# Altium schematic sheet SAMV71_Xplained_Ultra_Target_MCU.SchDoc: Target MCU
size A3; Organization: ATMEL Norway; Address1: Vestre Rosten 79; Address2: N-7075 TILLER; Address3: NORWAY; DocumentNumber: A09-2407; Revision: 2; SheetNumber: 5; SheetTotal: 13; PageSetup: Record=PageOptions|CenterHorizontal=True|CenterVertical=True|PrintScale=1.01|XCorrection=1.00|YCorrection=1.00|PrintKind=1|BorderSize=5000000|LeftOffset=0|BottomOffset=0|Orientation=2|PaperLength=1000|PaperWidth=1000|Scale=100|PaperSource=7|PrintQuality=-4|MediaType=1|DitherType=10|PaperKind=A3 (297 x 420 mm)|PrintScaleMode=1
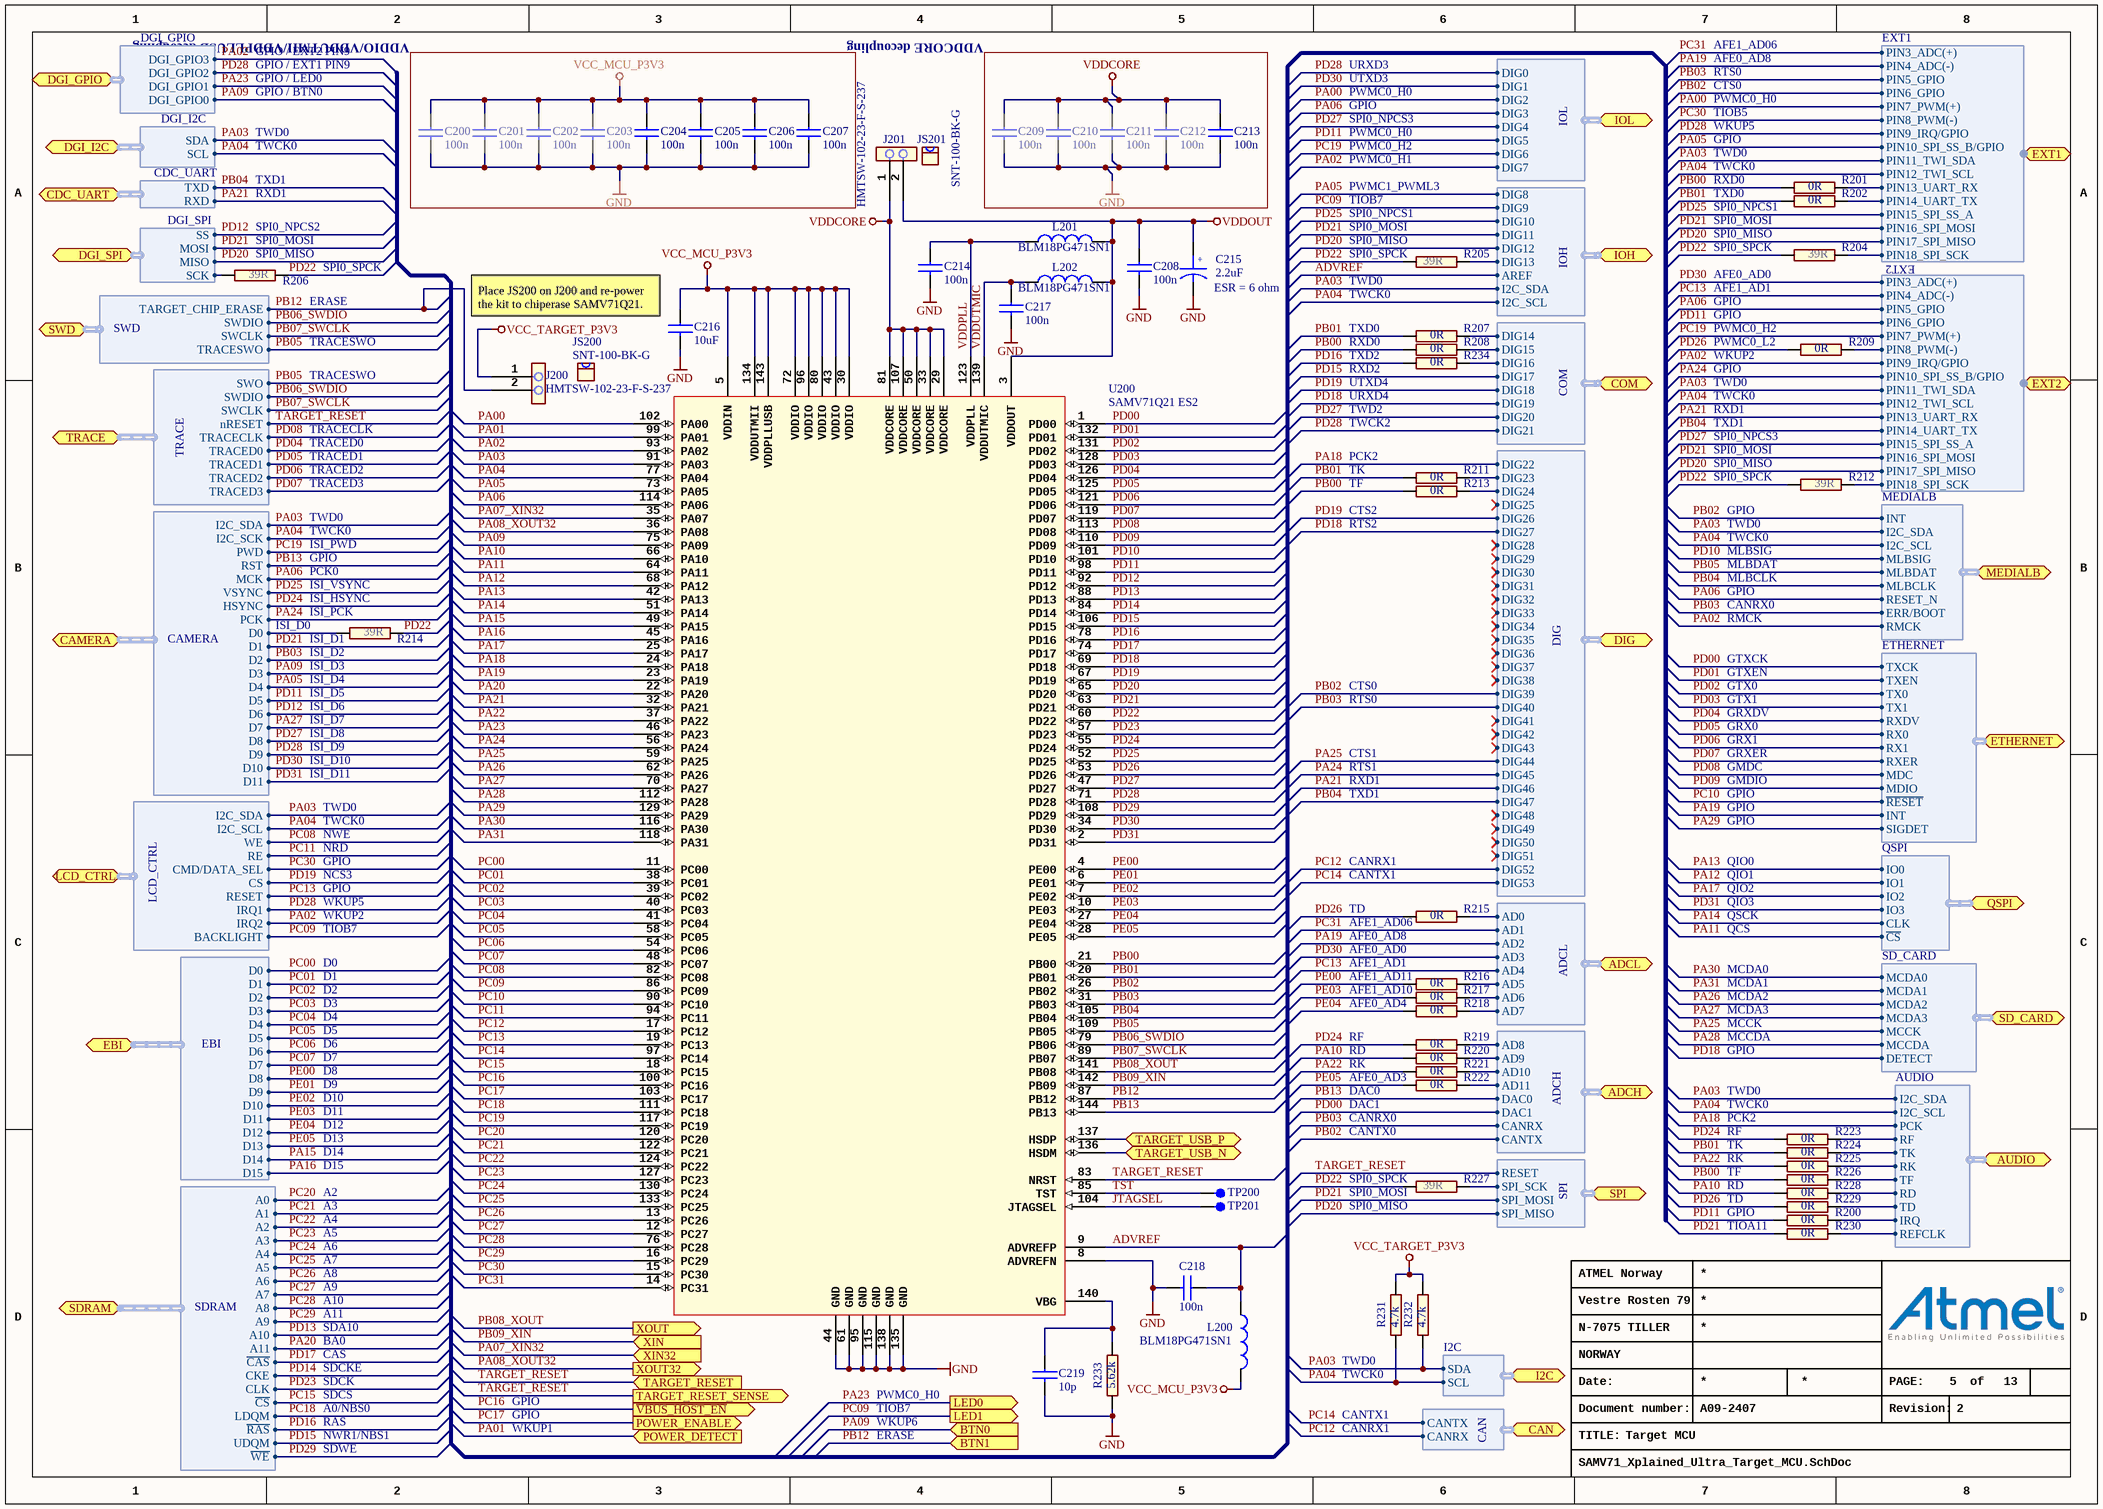
[diagram p0: SAMV71_Xplained_Ultra_Target_MCU.SchDoc]

## Parts
C200  value 100n  [AP1-00001]  (hidden comment: CAP-NONPOL)
C201  value 100n  [AP1-00001]  (hidden comment: CAP-NONPOL)
C202  value 100n  [AP1-00001]  (hidden comment: CAP-NONPOL)
C203  value 100n  [AP1-00001]  (hidden comment: CAP-NONPOL)
C204  value 100n  [AP1-00001]  (hidden comment: CAP-NONPOL)
C205  value 100n  [AP1-00001]  (hidden comment: CAP-NONPOL)
C206  value 100n  [AP1-00001]  (hidden comment: CAP-NONPOL)
C207  value 100n  [AP1-00001]  (hidden comment: CAP-NONPOL)
C208  value 100n  [AP1-00001]  (hidden comment: CAP-NONPOL)
C209  value 100n  [AP1-00001]  (hidden comment: CAP-NONPOL)
C210  value 100n  [AP1-00001]  (hidden comment: CAP-NONPOL)
C211  value 100n  [AP1-00001]  (hidden comment: CAP-NONPOL)
C212  value 100n  [AP1-00001]  (hidden comment: CAP-NONPOL)
C213  value 100n  [AP1-00001]  (hidden comment: CAP-NONPOL)
C214  value 100n  [AP1-00001]  (hidden comment: CAP-NONPOL)
C215  ESR = 6 ohm  value 2.2uF  [AP1-00036]
C216  value 10uF  [AP1-00041]  (hidden comment: CAP-NONPOL)
C217  value 100n  [AP1-00001]  (hidden comment: CAP-NONPOL)
C218  value 100n  [AP1-00001]  (hidden comment: CAP-NONPOL)
C219  10p  [AP1-00053]
J200  value HMTSW-102-23-F-S-237  [AP8-00733]  (hidden comment: HEADER 1x2)
J201  value HMTSW-102-23-F-S-237  [AP8-00733]  (hidden comment: HEADER 1x2)
JS200  value SNT-100-BK-G  [AP8-00525]
JS201  value SNT-100-BK-G  [AP8-00525]
L200  value BLM18PG471SN1  [AP3-00005]  (hidden comment: INDUCTOR)
L201  value BLM18PG471SN1  [AP3-00005]  (hidden comment: INDUCTOR)
L202  value BLM18PG471SN1  [AP3-00005]  (hidden comment: INDUCTOR)
R200  value 0R  [AP2-00000]  (hidden comment: R2)
R201  value 0R  [AP2-00000]  (hidden comment: R2)
R202  value 0R  [AP2-00000]  (hidden comment: R2)
R204  value 39R  [AP2-00000]  (hidden comment: R2)
R205  value 39R  [AP2-00000]  (hidden comment: R2)
R206  value 39R  [AP2-00000]  (hidden comment: R2)
R207  value 0R  [AP2-00000]  (hidden comment: R2)
R208  value 0R  [AP2-00000]  (hidden comment: R2)
R209  value 0R  [AP2-00000]  (hidden comment: R2)
R211  value 0R  [AP2-00000]  (hidden comment: R2)
R212  value 39R  [AP2-00000]  (hidden comment: R2)
R213  value 0R  [AP2-00000]  (hidden comment: R2)
R214  value 39R  [AP2-00000]  (hidden comment: R2)
R215  value 0R  [AP2-00000]  (hidden comment: R2)
R216  value 0R  [AP2-00000]  (hidden comment: R2)
R217  value 0R  [AP2-00000]  (hidden comment: R2)
R218  value 0R  [AP2-00000]  (hidden comment: R2)
R219  value 0R  [AP2-00000]  (hidden comment: R2)
R220  value 0R  [AP2-00000]  (hidden comment: R2)
R221  value 0R  [AP2-00000]  (hidden comment: R2)
R222  value 0R  [AP2-00000]  (hidden comment: R2)
R223  value 0R  [AP2-00000]  (hidden comment: R2)
R224  value 0R  [AP2-00000]  (hidden comment: R2)
R225  value 0R  [AP2-00000]  (hidden comment: R2)
R226  value 0R  [AP2-00000]  (hidden comment: R2)
R227  value 39R  [AP2-00000]  (hidden comment: R2)
R228  value 0R  [AP2-00000]  (hidden comment: R2)
R229  value 0R  [AP2-00000]  (hidden comment: R2)
R230  value 0R  [AP2-00000]  (hidden comment: R2)
R231  value 4.7k  [AP2-00000]  (hidden comment: R2)
R232  value 4.7k  [AP2-00000]  (hidden comment: R2)
R233  value 5.62k  [AP2-00000]  (hidden comment: R2)
R234  value 0R  [AP2-00000]  (hidden comment: R2)
TP200  TESTPOINT  [AP8-00010]  (value not drawn)  (no BOM)
TP201  TESTPOINT  [AP8-00010]  (value not drawn)  (no BOM)
U200  value SAMV71Q21 ES2  [AP6-00118]

## Blocks framed on the sheet
VDDIO/VDDUTMII/VDDPLLUSB decoupling: C200-C207
VDDCORE decoupling: C209-C213

## Ports
ADCH (harness ADCH), ADCL (harness ADCL), AUDIO (harness AUDIO), BTN0 (in), BTN1 (in), CAMERA (harness CAMERA), CAN (harness CAN), CDC_UART (harness CDC_UART), COM (harness COM), DGI_GPIO (harness DGI_GPIO), DGI_I2C (harness DGI_I2C), DGI_SPI (harness DGI_SPI), DIG (harness DIG), EBI (harness EBI), ETHERNET (harness ETHERNET), EXT1 (harness EXT1), EXT2 (harness EXT2), I2C (harness I2C), IOH (harness IOH), IOL (harness IOL), LCD_CTRL (harness LCD_CTRL), LED0 (out), LED1 (out), MEDIALB (harness MEDIALB), POWER_DETECT (in), POWER_ENABLE (out), QSPI (harness QSPI), SD_CARD (harness SD_CARD), SDRAM (harness SDRAM), SPI (harness SPI), SWD (harness SWD), TARGET_RESET (in), TARGET_RESET_SENSE (out), TARGET_USB_N (bidir), TARGET_USB_P (bidir), TRACE (harness TRACE), XIN32 (in), XIN (in), XOUT32 (out), XOUT (out), ~{VBUS_HOST_EN} (out)

## Harnesses
SWD: SWCLK, SWDIO, TARGET_CHIP_ERASE, TRACESWO
DGI_GPIO: DGI_GPIO0, DGI_GPIO1, DGI_GPIO2, DGI_GPIO3
DGI_SPI: MISO, MOSI, SCK, SS
DGI_I2C: SCL, SDA
CDC_UART: RXD, TXD
EXT1: PIN10_SPI_SS_B/GPIO, PIN11_TWI_SDA, PIN12_TWI_SCL, PIN13_UART_RX, PIN14_UART_TX, PIN15_SPI_SS_A, PIN16_SPI_MOSI, PIN17_SPI_MISO, PIN18_SPI_SCK, PIN3_ADC(+), PIN4_ADC(-), PIN5_GPIO, PIN6_GPIO, PIN7_PWM(+), PIN8_PWM(-), PIN9_IRQ/GPIO
EXT2: PIN10_SPI_SS_B/GPIO, PIN11_TWI_SDA, PIN12_TWI_SCL, PIN13_UART_RX, PIN14_UART_TX, PIN15_SPI_SS_A, PIN16_SPI_MOSI, PIN17_SPI_MISO, PIN18_SPI_SCK, PIN3_ADC(+), PIN4_ADC(-), PIN5_GPIO, PIN6_GPIO, PIN7_PWM(+), PIN8_PWM(-), PIN9_IRQ/GPIO
EBI: D0, D1, D2, D3, D4, D5, D6, D7, D8, D9, D10, D11, D12, D13, D14, D15
CAMERA: MCK, VSYNC, HSYNC, PCK, D0, D1, D2, D3, D4, D5, D6, D7, D8, D9, D10, D11, I2C_SCK, I2C_SDA, RST, PWD
ETHERNET: TX0, TX1, TXEN, TXCK, RX0, RX1, MDC, MDIO, RXER, RXDV, INT, ~{RESET}, SIGDET
QSPI: CLK, IO3, IO2, IO0, IO1, ~{CS}
SDRAM: ~{CAS}, ~{RAS}, ~{CS}, CLK, CKE, ~{WE}, LDQM, UDQM, A0, A1, A2, A3, A4, A5, A6, A7, A8, A9, A10, A11
SD_CARD: MCCDA, MCCK, MCDA3, MCDA2, MCDA1, MCDA0, DETECT
AUDIO: I2C_SDA, I2C_SCL, PCK, TK, RK, TF, RD, TD, IRQ, REFCLK, RF
ADCL: AD0, AD1, AD2, AD3, AD4, AD5, AD6, AD7
ADCH: AD8, AD9, AD10, AD11, DAC0, DAC1, CANRX, CANTX
DIG: DIG22, DIG23, DIG24, DIG25, DIG26, DIG27, DIG28, DIG29, DIG30, DIG31, DIG32, DIG33, DIG34, DIG35, DIG36, DIG37, DIG38, DIG39, DIG40, DIG41, DIG42, DIG43, DIG44, DIG45, DIG46, DIG47, DIG48, DIG49, DIG50, DIG51, DIG52, DIG53
CAN: CANTX, CANRX
I2C: SDA, SCL
LCD_CTRL: CMD/DATA_SEL, CS, WE, RE, I2C_SDA, I2C_SCL, IRQ1, IRQ2, BACKLIGHT, RESET
SPI: SPI_MISO, SPI_MOSI, SPI_SCK, RESET
TRACE: SWDIO, SWCLK, TRACECLK, TRACED0, TRACED1, TRACED2, TRACED3, nRESET, SWO
MEDIALB: MLBSIG, MLBDAT, MLBCLK, I2C_SDA, I2C_SCL, INT, ERR/BOOT, RESET_N, RMCK
COM: DIG14, DIG15, DIG16, DIG17, DIG18, DIG19, DIG20, DIG21
IOH: DIG8, DIG9, DIG10, DIG11, DIG12, DIG13, AREF, I2C_SCL, I2C_SDA
IOL: DIG0, DIG1, DIG2, DIG3, DIG4, DIG5, DIG6, DIG7

## Nets
GND: C200.2 C201.2 C202.2 C203.2 C204.2 C205.2 C206.2 C207.2 C208.2 C209.2 C210.2 C211.2 C212.2 C213.2 C214.2 C215.2 C216.2 C217.2 C218.2 C219.2 R233.1 U200.8(ADVREFN) U200.44(GND) U200.61(GND) U200.95(GND) U200.115(GND) U200.135(GND) U200.138(GND)
VCC_MCU_P3V3: C200.1 C201.1 C202.1 C203.1 C204.1 C205.1 C206.1 C207.1 C216.1 L200.1 U200.5(VDDIN) U200.30(VDDIO) U200.43(VDDIO) U200.72(VDDIO) U200.80(VDDIO) U200.96(VDDIO) U200.134(VDDUTMII) U200.143(VDDPLLUSB)
VCC_TARGET_P3V3: J200.1 R231.1 R232.1
VDDCORE: C209.1 C210.1 C211.1 C212.1 C213.1 J201.1 U200.29(VDDCORE) U200.33(VDDCORE) U200.50(VDDCORE) U200.81(VDDCORE) U200.107(VDDCORE)
VDDOUT: C208.1 C215.1 J201.2 L201.1 L202.1 U200.3(VDDOUT)
ADVREF: C218.1 L200.2 U200.9(ADVREFP) ; port IOH.AREF
JTAGSEL: TP201.1 U200.104(JTAGSEL)
PA00: U200.102(PA00) ; port EXT1.PIN7_PWM(+), port IOL.DIG2
PA01: U200.99(PA01) ; port POWER_DETECT
PA02: U200.93(PA02) ; port DGI_GPIO.DGI_GPIO3, port EXT2.PIN9_IRQ/GPIO, port LCD_CTRL.IRQ2, port MEDIALB.RMCK, port IOL.DIG7
PA03: R232.2 U200.91(PA03) ; port DGI_I2C.SDA, port EXT1.PIN11_TWI_SDA, port EXT2.PIN11_TWI_SDA, port CAMERA.I2C_SDA, port AUDIO.I2C_SDA, port I2C.SDA, port LCD_CTRL.I2C_SDA, port MEDIALB.I2C_SDA, port IOH.I2C_SDA
PA04: R231.2 U200.77(PA04) ; port DGI_I2C.SCL, port EXT1.PIN12_TWI_SCL, port EXT2.PIN12_TWI_SCL, port CAMERA.I2C_SCK, port AUDIO.I2C_SCL, port I2C.SCL, port LCD_CTRL.I2C_SCL, port MEDIALB.I2C_SCL, port IOH.I2C_SCL
PA05: U200.73(PA05) ; port EXT1.PIN10_SPI_SS_B/GPIO, port CAMERA.D4, port IOH.DIG8
PA06: U200.114(PA06) ; port EXT2.PIN5_GPIO, port CAMERA.MCK, port MEDIALB.RESET_N, port IOL.DIG3
PA07_XIN32: U200.35(PA07) ; port XIN32
PA08_XOUT32: U200.36(PA08) ; port XOUT32
PA09: U200.75(PA09) ; port BTN0, port DGI_GPIO.DGI_GPIO0, port CAMERA.D3
PA10: R220.1 R228.1 U200.66(PA10)
PA11: U200.64(PA11) ; port QSPI.~{CS}
PA12: U200.68(PA12) ; port QSPI.IO1
PA13: U200.42(PA13) ; port QSPI.IO0
PA14: U200.51(PA14) ; port QSPI.CLK
PA15: U200.49(PA15) ; port EBI.D14
PA16: U200.45(PA16) ; port EBI.D15
PA17: U200.25(PA17) ; port QSPI.IO2
PA18: U200.24(PA18) ; port AUDIO.PCK, port DIG.DIG22
PA19: U200.23(PA19) ; port EXT1.PIN4_ADC(-), port ETHERNET.INT, port ADCL.AD2
PA20: U200.22(PA20) ; port SDRAM.A11
PA21: U200.32(PA21) ; port CDC_UART.RXD, port EXT2.PIN13_UART_RX, port DIG.DIG46
PA22: R221.1 R225.1 U200.37(PA22)
PA23: U200.46(PA23) ; port LED0, port DGI_GPIO.DGI_GPIO1
PA24: U200.56(PA24) ; port EXT2.PIN10_SPI_SS_B/GPIO, port CAMERA.PCK, port DIG.DIG45
PA25: U200.59(PA25) ; port SD_CARD.MCCK, port DIG.DIG44
PA26: U200.62(PA26) ; port SD_CARD.MCDA2
PA27: U200.70(PA27) ; port CAMERA.D7, port SD_CARD.MCDA3
PA28: U200.112(PA28) ; port SD_CARD.MCCDA
PA29: U200.129(PA29) ; port ETHERNET.SIGDET
PA30: U200.116(PA30) ; port SD_CARD.MCDA0
PA31: U200.118(PA31) ; port SD_CARD.MCDA1
PB00: R201.1 R208.1 R213.1 R226.1 U200.21(PB00)
PB01: R202.1 R207.1 R211.1 R224.1 U200.20(PB01)
PB02: U200.26(PB02) ; port EXT1.PIN6_GPIO, port ADCH.CANTX, port DIG.DIG39, port MEDIALB.INT
PB03: U200.31(PB03) ; port EXT1.PIN5_GPIO, port CAMERA.D2, port ADCH.CANRX, port DIG.DIG40, port MEDIALB.ERR/BOOT
PB04: U200.105(PB04) ; port CDC_UART.TXD, port EXT2.PIN14_UART_TX, port DIG.DIG47, port MEDIALB.MLBCLK
PB05: U200.109(PB05) ; port SWD.TRACESWO, port TRACE.SWO, port MEDIALB.MLBDAT
PB06_SWDIO: U200.79(PB06) ; port SWD.SWDIO, port TRACE.SWDIO
PB07_SWCLK: U200.89(PB07) ; port SWD.SWCLK, port TRACE.SWCLK
PB08_XOUT: U200.141(PB08) ; port XOUT
PB09_XIN: U200.142(PB09) ; port XIN
PB12: J200.2 U200.87(PB12) ; port BTN1, port SWD.TARGET_CHIP_ERASE
PB13: U200.144(PB13) ; port CAMERA.RST, port ADCH.DAC0
PC00: U200.11(PC00) ; port EBI.D0
PC01: U200.38(PC01) ; port EBI.D1
PC02: U200.39(PC02) ; port EBI.D2
PC03: U200.40(PC03) ; port EBI.D3
PC04: U200.41(PC04) ; port EBI.D4
PC05: U200.58(PC05) ; port EBI.D5
PC06: U200.54(PC06) ; port EBI.D6
PC07: U200.48(PC07) ; port EBI.D7
PC08: U200.82(PC08) ; port LCD_CTRL.WE
PC09: U200.86(PC09) ; port LED1, port LCD_CTRL.BACKLIGHT, port IOH.DIG9
PC10: U200.90(PC10) ; port ETHERNET.~{RESET}
PC11: U200.94(PC11) ; port LCD_CTRL.RE
PC12: U200.17(PC12) ; port DIG.DIG52, port CAN.CANRX
PC13: U200.19(PC13) ; port EXT2.PIN4_ADC(-), port ADCL.AD4, port LCD_CTRL.RESET
PC14: U200.97(PC14) ; port DIG.DIG53, port CAN.CANTX
PC15: U200.18(PC15) ; port SDRAM.~{CS}
PC16: U200.100(PC16) ; port ~{VBUS_HOST_EN}
PC17: U200.103(PC17) ; port POWER_ENABLE
PC18: U200.111(PC18) ; port SDRAM.LDQM
PC19: U200.117(PC19) ; port EXT2.PIN7_PWM(+), port CAMERA.PWD, port IOL.DIG6
PC20: U200.120(PC20) ; port SDRAM.A0
PC21: U200.122(PC21) ; port SDRAM.A1
PC22: U200.124(PC22) ; port SDRAM.A2
PC23: U200.127(PC23) ; port SDRAM.A3
PC24: U200.130(PC24) ; port SDRAM.A4
PC25: U200.133(PC25) ; port SDRAM.A5
PC26: U200.13(PC26) ; port SDRAM.A6
PC27: U200.12(PC27) ; port SDRAM.A7
PC28: U200.76(PC28) ; port SDRAM.A8
PC29: U200.16(PC29) ; port SDRAM.A9
PC30: U200.15(PC30) ; port EXT1.PIN8_PWM(-), port LCD_CTRL.CMD/DATA_SEL
PC31: U200.14(PC31) ; port EXT1.PIN3_ADC(+), port ADCL.AD1
PD00: U200.1(PD00) ; port ETHERNET.TXCK, port ADCH.DAC1
PD01: U200.132(PD01) ; port ETHERNET.TXEN
PD02: U200.131(PD02) ; port ETHERNET.TX0
PD03: U200.128(PD03) ; port ETHERNET.TX1
PD04: U200.126(PD04) ; port ETHERNET.RXDV, port TRACE.TRACED0
PD05: U200.125(PD05) ; port ETHERNET.RX0, port TRACE.TRACED1
PD06: U200.121(PD06) ; port ETHERNET.RX1, port TRACE.TRACED2
PD07: U200.119(PD07) ; port ETHERNET.RXER, port TRACE.TRACED3
PD08: U200.113(PD08) ; port ETHERNET.MDC, port TRACE.TRACECLK
PD09: U200.110(PD09) ; port ETHERNET.MDIO
PD10: U200.101(PD10) ; port MEDIALB.MLBSIG
PD11: R200.1 U200.98(PD11) ; port EXT2.PIN6_GPIO, port CAMERA.D5, port IOL.DIG5
PD12: U200.92(PD12) ; port DGI_SPI.SS, port CAMERA.D6
PD13: U200.88(PD13) ; port SDRAM.A10
PD14: U200.84(PD14) ; port SDRAM.CKE
PD15: U200.106(PD15) ; port SDRAM.UDQM, port COM.DIG17
PD16: R234.1 U200.78(PD16) ; port SDRAM.~{RAS}
PD17: U200.74(PD17) ; port SDRAM.~{CAS}
PD18: U200.69(PD18) ; port SD_CARD.DETECT, port DIG.DIG27, port COM.DIG19
PD19: U200.67(PD19) ; port DIG.DIG26, port LCD_CTRL.CS, port COM.DIG18
PD20: U200.65(PD20) ; port DGI_SPI.MISO, port EXT1.PIN17_SPI_MISO, port EXT2.PIN17_SPI_MISO, port SPI.SPI_MISO, port IOH.DIG12
PD21: R230.1 U200.63(PD21) ; port DGI_SPI.MOSI, port EXT1.PIN16_SPI_MOSI, port EXT2.PIN16_SPI_MOSI, port CAMERA.D1, port SPI.SPI_MOSI, port IOH.DIG11
PD22: R204.1 R205.1 R206.2 R212.1 R214.2 R227.1 U200.60(PD22)
PD23: U200.57(PD23) ; port SDRAM.CLK
PD24: R219.1 R223.1 U200.55(PD24) ; port CAMERA.HSYNC
PD25: U200.52(PD25) ; port EXT1.PIN15_SPI_SS_A, port CAMERA.VSYNC, port IOH.DIG10
PD26: R209.1 R215.1 R229.1 U200.53(PD26)
PD27: U200.47(PD27) ; port EXT2.PIN15_SPI_SS_A, port CAMERA.D8, port COM.DIG20, port IOL.DIG4
PD28: U200.71(PD28) ; port DGI_GPIO.DGI_GPIO2, port EXT1.PIN9_IRQ/GPIO, port CAMERA.D9, port LCD_CTRL.IRQ1, port COM.DIG21, port IOL.DIG0
PD29: U200.108(PD29) ; port SDRAM.~{WE}
PD30: U200.34(PD30) ; port EXT2.PIN3_ADC(+), port CAMERA.D10, port ADCL.AD3, port IOL.DIG1
PD31: U200.2(PD31) ; port CAMERA.D11, port QSPI.IO3
PE00: R216.1 U200.4(PE00) ; port EBI.D8
PE01: U200.6(PE01) ; port EBI.D9
PE02: U200.7(PE02) ; port EBI.D10
PE03: R217.1 U200.10(PE03) ; port EBI.D11
PE04: R218.1 U200.27(PE04) ; port EBI.D12
PE05: R222.1 U200.28(PE05) ; port EBI.D13
TARGET_RESET: U200.83(NRST) ; port TARGET_RESET_SENSE, port TARGET_RESET, port SPI.RESET, port TRACE.nRESET
TARGET_USB_N: U200.136(HSDM) ; port TARGET_USB_N
TARGET_USB_P: U200.137(HSDP) ; port TARGET_USB_P
TST: TP200.1 U200.85(TST)
VDDPLL: C214.1 L201.2 U200.123(VDDPLL)
VDDUTMIC: C217.1 L202.2 U200.139(VDDUTMIC)
NetC219_1: C219.1 R233.2 U200.140(VBG)
NetR200_2: R200.2 ; port AUDIO.IRQ
NetR201_2: R201.2 ; port EXT1.PIN13_UART_RX
NetR202_2: R202.2 ; port EXT1.PIN14_UART_TX
NetR204_2: R204.2 ; port EXT1.PIN18_SPI_SCK
NetR205_2: R205.2 ; port IOH.DIG13
NetR206_1: R206.1 ; port DGI_SPI.SCK
NetR207_2: R207.2 ; port COM.DIG14
NetR208_2: R208.2 ; port COM.DIG15
NetR209_2: R209.2 ; port EXT2.PIN8_PWM(-)
NetR211_2: R211.2 ; port DIG.DIG23
NetR212_2: R212.2 ; port EXT2.PIN18_SPI_SCK
NetR213_2: R213.2 ; port DIG.DIG24
NetR214_1: R214.1 ; port CAMERA.D0
NetR215_2: R215.2 ; port ADCL.AD0
NetR216_2: R216.2 ; port ADCL.AD5
NetR217_2: R217.2 ; port ADCL.AD6
NetR218_2: R218.2 ; port ADCL.AD7
NetR219_2: R219.2 ; port ADCH.AD8
NetR220_2: R220.2 ; port ADCH.AD9
NetR221_2: R221.2 ; port ADCH.AD10
NetR222_2: R222.2 ; port ADCH.AD11
NetR223_2: R223.2 ; port AUDIO.RF
NetR224_2: R224.2 ; port AUDIO.TK
NetR225_2: R225.2 ; port AUDIO.RK
NetR226_2: R226.2 ; port AUDIO.TF
NetR227_2: R227.2 ; port SPI.SPI_SCK
NetR228_2: R228.2 ; port AUDIO.RD
NetR229_2: R229.2 ; port AUDIO.TD
NetR230_2: R230.2 ; port AUDIO.REFCLK
NetR234_2: R234.2 ; port COM.DIG16

## Notes on the sheet
- AFE1_AD06
- GPIO / BTN0
- GPIO / LED0
- GPIO / EXT2 PIN9
- GPIO / EXT1 PIN9
- PWMC0_H0
- GPIO
- URXD3
- UTXD3
- RTS0
- CTS0
- AFE0_AD8
- TWCK0
- TWD0
- TXD1
- SPI0_NPCS3
- PWMC0_H2
- PWMC0_H1
- TIOB5
- RXD0
- WKUP5
- (near R206) SPI0_MOSI
- (near R206) SPI0_NPCS2
- RXD1
- (near R205) SPI0_MOSI
- (near R205) SPI0_MISO
- (near R205) SPI0_NPCS1
- PWMC1_PWML3
- TIOB7
- TXD0
- SPI0_NPCS1
- SPI0_MOSI
- SPI0_MISO
- (near R206) SPI0_MISO
- (near R206) ERASE
- (near R206) SPI0_SPCK
- (near C216) Place JS200 on J200 and re-power the kit to chiperase SAMV71Q21.
- (near R205) SPI0_SPCK
- (near R204) SPI0_SPCK
- AFE1_AD1
- (near R204) AFE0_AD0
- TRACESWO
- TXD2
- RXD2
- (near R209) PWMC0_H2
- (near R209) PWMC0_L2
- WKUP2
- TRACECLK
- TRACED0
- UTXD4
- URXD4
- TWD2
- TWCK2
- (near R212) SPI0_MOSI
- (near R212) SPI0_NPCS3
- TRACED1
- TRACED2
- TRACED3
- PCK2
- TK
- TF
- CTS2
- (near R212) SPI0_MISO
- (near R212) SPI0_SPCK
- (near R212) GPIO
- ISI_PWD
- PCK0
- (near R214) ISI_VSYNC
- RTS2
- MLBSIG
- MLBDAT
- MLBCLK
- (near R214) ISI_D0
- (near R214) ISI_PCK
- (near R214) ISI_HSYNC
- (near R214) ISI_D1
- RMCK
- CANRX0
- (near R214) ISI_D2
- (near R214) ISI_D3
- (near R214) ISI_D4
- ISI_D5
- ISI_D6
- ISI_D7
- GTXCK
- GTXEN
- GTX0
- GTX1
- GRXDV
- ISI_D8
- ISI_D9
- ISI_D10
- ISI_D11
- CTS1
- RTS1
- GRX0
- GRX1
- GRXER
- GMDC
- GMDIO
- NWE
- NRD
- NCS3
- TD
- (near R215) CANTX1
- CANRX1
- QIO0
- QIO1
- QIO2
- QIO3
- QSCK
- D0
- D1
- D2
- (near R215) AFE0_AD8
- AFE1_AD11
- AFE1_AD10
- AFE0_AD0
- (near R215) AFE1_AD06
- MCDA0
- MCDA1
- QCS
- D3
- D4
- D5
- D6
- RF
- RD
- AFE0_AD4
- MCDA2
- MCDA3
- MCCK
- MCCDA
- D7
- D8
- D9
- D10
- D11
- D12
- DAC0
- DAC1
- RK
- AFE0_AD3
- D13
- D14
- D15
- (near R227) SPI0_SPCK
- CANTX0
- A2
- A3
- A4
- A5
- A6
- A7
- (near R227) SPI0_MOSI
- (near R227) SPI0_MISO
- TIOA11
- A8
- A9
- A10
- A11
- SDA10
- BA0
- CAS
- SDCKE
- SDCK
- SDCS
- (near R231) TWD0
- A0/NBS0
- RAS
- NWR1/NBS1
- SDWE
- WKUP1
- WKUP6
- ERASE
- CANTX1
- Date:
- PAGE:
- of
- TITLE:
- Document number:
- Revision:
- (in symbol A01-0492) +

## Library data of the parts
C200-C214 C217 C218 = A01-0246: Ceramic capacitor, SMD 0402, X7R, 16V, +/-10%; PartGroup: Capacitors,Ceramic,SMD 0402; Manufacturer: Kemet; MPN: C0402C104K4RACTU; TemperatureRange: -55 - +125 deg C; AN: A01-0246; Tolerance: 16V, +/-10%; Height: 0,5
C215 = A01-0492: Capacitor Tantalum 10V 2.2uF 10% ESR = 6 ohm; PartGroup: Capacitors,Tantalum; Manufacturer: Kemet; MPN: T494A225K010AT; TemperatureRange: - 55 C to + 125 C; AN: A01-0492; Tolerance: ±10%; Height: 1,79999995231628
C216 = A01-0360: Ceramic capacitor, SMD 0805, X7R, 10V, 10 %, (de19441); PartGroup: Capacitors,Ceramic,SMD 0805; Manufacturer: Murata; MPN: GRM21BR61A106KE19L; Tolerance: 10%; TemperatureRange: -55 - +85 deg C; AN: A01-0360; Height: 1,25
C219 = A01-0015: Ceramic capacitor, SMD 0402, NP0, 50V, +/-5%; PartGroup: Capacitors,Ceramic,SMD 0402; TemperatureRange: -55 - +125 deg C; AN: A01-0015; Value: 10p; Tolerance: 50V, +/-5%; Height: 0,550000011920929
J200 J201 = A08-1754: 1x2 pin header, 2.54mm pitch, Pin-in-Paste THM; PartGroup: Mechanical devices,Connectors,Pin headers; Manufacturer: SAMTEC; TemperatureRange: - 55 deg C to + 125 deg C; AN: A08-1754; Height: 6,09999990463257; MPN: HMTSW-102-23-F-S-237
JS200 JS201 = A08-0543: Jumper cap for 2.54mm pinheader; PartGroup: Mechanical devices,Mounting accessories,Other; Manufacturer: SAMTEC; AN: A08-0543; MPN: SNT-100-BK-G
L200-L202 = A03-0035: SMD RF inductor 0603. Z=470Ohm (@100MHz), Max R(dc)=0.65Ohm, Max current=1A; PartGroup: Inductors,EMI; Manufacturer: Murata; Tolerance: ±25%; TemperatureRange: -55°C to +125°C; AN: A03-0035; Height: 0,800000011920929; MPN: BLM18PG471SN1
R200-R202 R207-R209 R211 R213 R215-R226 R228-R230 R234 = A02-0163: RES 0.0 OHM 1/16W 0402 SMD; PartGroup: Resistors,SMD,0402 1%; Manufacturer: (n/a); MPN: RMCF0402ZT0R00; Tolerance: 1 %; TemperatureRange: -55 - +125 deg C; AN: A02-0163; Height: 0.349999994039536
R204-R206 R212 R214 R227 = A02-0178: Thick film resistor, SMD 0402, 1/16W, 1%; PartGroup: Resistors,SMD,0402 1%; TemperatureRange: -55 - +125 deg C; AN: A02-0178; Tolerance: 1 %; Height: 0,349999994039536
R231 R232 = A02-0228: Thick film resistor, SMD 0402, 1/16W, 1%; PartGroup: Resistors,SMD,0402 1%; TemperatureRange: -55ï¿½ to +125ï¿½C; AN: A02-0228; Tolerance: 1 %; Height: 0,349999994039536
R233 = A02-0929: Thick film resistor, SMD 0402, 1/16W, 1%; PartGroup: Resistors,SMD,0402 1%; TemperatureRange: -55 - +125 deg C; AN: A02-0929; Tolerance: 1 %; Height: 0,349999994039536
TP200 TP201 = A08-0004: Single SMD testpad; PartGroup: Mechanical devices,Connectors,Test points; AN: A08-0004; Value: TESTPAD; Height: 0
U200 = A06-1254: SAM 32-bit ARM Cortex-M* RISC MCU, SAMV71 Series, QFP144; PartGroup: Integrated Circuits,MCU, MPU, DSP,ARM MCU; TemperatureRange: -40Â°C to +105Â°C; AN: A06-1254; Height: 1,60000002384186